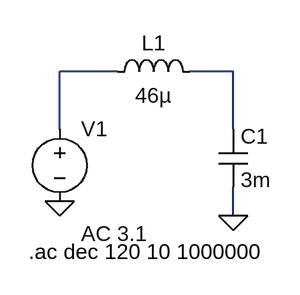
[diagram p0: schematic boostac.asc]
boostac.asc, the LTspice schematic file:
Version 4
SHEET 1 880 680
WIRE 112 112 48 112
WIRE 240 112 192 112
WIRE 48 176 48 112
WIRE 240 176 240 112
WIRE 240 272 240 240
FLAG 240 272 0
FLAG 48 256 0
SYMBOL ind 96 128 R270
WINDOW 0 32 56 VTop 0
WINDOW 3 5 56 VBottom 0
SYMATTR InstName L1
SYMATTR Value 46µ
SYMATTR SpiceLine Rser=35m
SYMBOL cap 224 176 R0
SYMATTR InstName C1
SYMATTR Value 3m
SYMATTR SpiceLine Rser=120m
SYMBOL voltage 48 160 R0
WINDOW 123 24 132 Left 0
WINDOW 39 0 0 Left 0
SYMATTR InstName V1
SYMATTR Value ""
SYMATTR Value2 AC 3.1
TEXT 14 312 Left 0 !.ac dec 120 10 1000000

The netlist it stands for:
* boostac.asc
L1 N001 N002 46µ Rser=35m
C1 N002 0 3m Rser=120m
V1 N001 0 AC 3.1
.ac dec 120 10 1000000
.backanno
.end